# EAGLE design nanoHC06Rx (EAGLE 9.6.1)
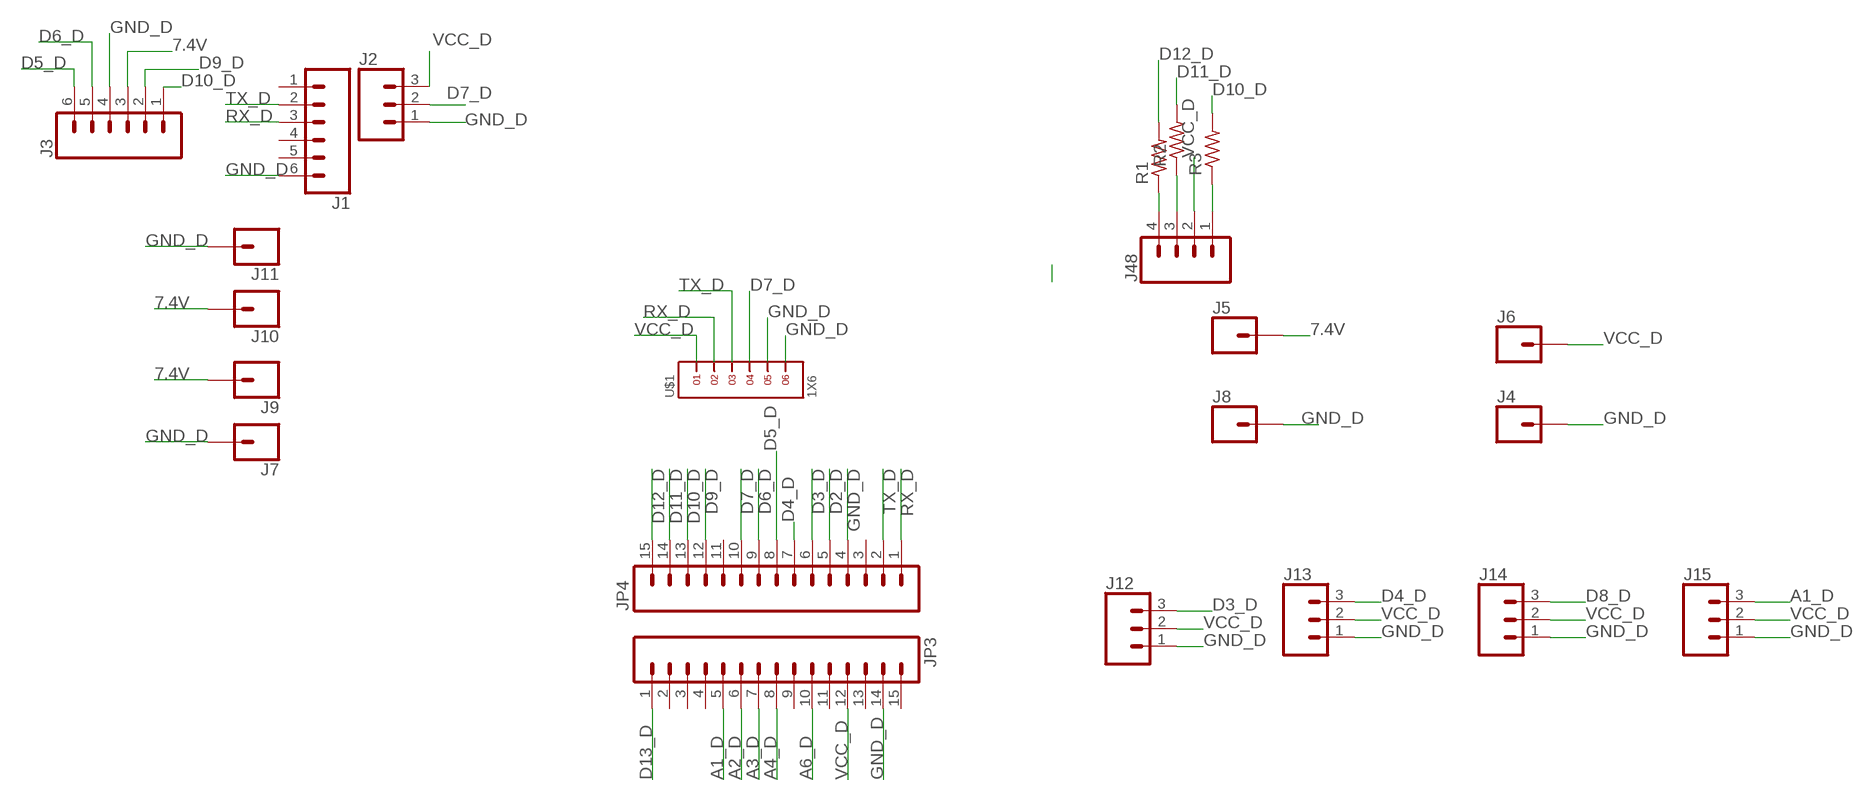
[diagram p0: schematic, sheet 1]

## Parts
J1  CONN_06SILK_FEMALE_PTH  [1X06]
J2  CONN_03  [1X03]
J3  CONN_06SILK_FEMALE_PTH  [1X06]
J4  CONN_01  [1X01]
J5  CONN_01  [1X01]
J6  CONN_01  [1X01]
J7  CONN_01  [1X01]
J8  CONN_01  [1X01]
J9  CONN_01  [1X01]
J10  CONN_01  [1X01]
J11  CONN_01  [1X01]
J12  CONN_03  [1X03]
J13  CONN_03  [1X03]
J14  CONN_03  [1X03]
J15  CONN_03  [1X03]
J48  CONN_04  [1X04]
JP3  M15  [1X15@1]
JP4  M15  [1X15@1]
R1  R-US_0309/10  [0309/10]
R2  R-US_0309/10  [0309/10]
R3  R-US_0309/10  [0309/10]
U$1  1X6  [1X6]

## Nets
7.4V: J3.3 J5.1 J9.1 J10.1
A1_D: J15.3 JP3.5
A2_D: JP3.6
A3_D: JP3.7
A4_D: JP3.8
A6_D: JP3.10
D2_D: JP4.5
D3_D: J12.3 JP4.6
D4_D: J13.3 JP4.7
D5_D: J3.6 JP4.8
D6_D: J3.5 JP4.9
D7_D: J2.2 JP4.10 U$1.4
D8_D: J14.3
D9_D: J3.2 JP4.12
D10_D: J3.1 JP4.13 R3.2
D11_D: JP4.14 R2.2
D12_D: JP4.15 R1.2
D13_D: JP3.1
GND_D: J1.6 J2.1 J3.4 J4.1 J7.1 J8.1 J11.1 J12.1 J13.1 J14.1 J15.1 JP3.14 JP4.4 U$1.5 U$1.6
N$2: J48.4 R1.1
N$3: J48.3 R2.1
N$4: J48.1 R3.1
RX_D: J1.3 JP4.1 U$1.2
TX_D: J1.2 JP4.2 U$1.3
VCC_D: J2.3 J6.1 J12.2 J13.2 J14.2 J15.2 J48.2 JP3.12 U$1.1
Unconnected: J1.1 J1.4 J1.5 JP3.2 JP3.3 JP3.4 JP3.9 JP3.11 JP3.13 JP3.15 JP4.3 JP4.11

## Library data of the parts
J1 J3 = SparkFun-Connectors:CONN_06: Multi connection point. Often used as Generic Header-pin footprint for 0.1 inch spaced/style header connections On any of the 0.1 inch spaced packages, you can populate with these: Break Away Headers - Straight <https://www.sparkfun.com/products/116> (PRT-00116) Break Away Male Headers - Right Angle <https://www.sparkfun.com/products/553> (PRT-00553) Female Headers <https://www.sparkfun.com/products/115> (PRT-00115) Break Away Headers - Machine Pin <https://www.sparkfun.com/products/117> (PRT-00117) Break Away Female Headers - Swiss Machine Pin <https://www.sparkfun.com/products/743> (PRT-00743) Arduino Stackable Header - 6 Pin <https://www.sparkfun.com/products/9280> (PRT-09280) For SCREWTERMINALS and SPRING TERMINALS visit here: Screw Terimnals on SparkFun.com <https://www.sparkfun.com/search/results?term=Screw+Terminals> (5mm/3.5mm/2.54mm spacing) This device is also useful as a general connection point to wire up your design to another part of your project. Our various solder wires solder well into these plated through hole pads. Hook-Up Wire - Assortment (Stranded, 22 AWG) <https://www.sparkfun.com/products/11375> (PRT-11375) Hook-Up Wire - Assortment (Solid Core, 22 AWG) <https://www.sparkfun.com/products/11367> (PRT-11367) View the entire wire category on our website here <https://www.sparkfun.com/categories/141>; PROD_ID: CONN-08437
J2 J12-J15 = SparkFun-Connectors:CONN_03: Multi connection point. Often used as Generic Header-pin footprint for 0.1 inch spaced/style header connections On any of the 0.1 inch spaced packages, you can populate with these: Break Away Headers - Straight <https://www.sparkfun.com/products/116> (PRT-00116) Break Away Male Headers - Right Angle <https://www.sparkfun.com/products/553> (PRT-00553) Female Headers <https://www.sparkfun.com/products/115> (PRT-00115) Break Away Headers - Machine Pin <https://www.sparkfun.com/products/117> (PRT-00117) Break Away Female Headers - Swiss Machine Pin <https://www.sparkfun.com/products/743> (PRT-00743) Stackable Header - 3 Pin (Female, 0.1") <https://www.sparkfun.com/products/13875> (PRT-13875) For SCREWTERMINALS and SPRING TERMINALS visit here: Screw Terimnals on SparkFun.com <https://www.sparkfun.com/search/results?term=Screw+Terminals> (5mm/3.5mm/2.54mm spacing) This device is also useful as a general connection point to wire up your design to another part of your project. Our various solder wires solder well into these plated through hole pads. Hook-Up Wire - Assortment (Stranded, 22 AWG) <https://www.sparkfun.com/products/11375> (PRT-11375) Hook-Up Wire - Assortment (Solid Core, 22 AWG) <https://www.sparkfun.com/products/11367> (PRT-11367) View the entire wire category on our website here <https://www.sparkfun.com/categories/141> Special notes: Molex polarized connector foot print use with SKU : PRT-08232 with associated crimp pins and housings.
J4-J11 = SparkFun-Connectors:CONN_01: Single connection point. Often used as Generic Header-pin footprint for 0.1 inch spaced/style header connections On any of the 0.1 inch spaced packages, you can populate with these: Break Away Headers - Straight <https://www.sparkfun.com/products/116> (PRT-00116) Break Away Male Headers - Right Angle <https://www.sparkfun.com/products/553> (PRT-00553) Female Headers <https://www.sparkfun.com/products/115> (PRT-00115) Break Away Headers - Machine Pin <https://www.sparkfun.com/products/117> (PRT-00117) Break Away Female Headers - Swiss Machine Pin <https://www.sparkfun.com/products/743> (PRT-00743) This device is also useful as a general connection point to wire up your design to another part of your project. Our various solder wires solder well into these plated through hole pads. Hook-Up Wire - Assortment (Stranded, 22 AWG) <https://www.sparkfun.com/products/11375> (PRT-11375) Hook-Up Wire - Assortment (Solid Core, 22 AWG) <https://www.sparkfun.com/products/11367> (PRT-11367) View the entire wire category on our website here <https://www.sparkfun.com/categories/141> Special notes: SMTSO-256-ET is a "flush mount" nut for a 4-40 screw. We mostly use this on specialty testbeds; it is a nice way to connect hardware to your PCB at an adjustable hieght. Also note, the SNAP packages are for using a snappable style connector. We sell a baggie of snaps and they are also used on two LilyPad designs: Snap Assortment - 30 pack (male and female) <https://www.sparkfun.com/products/11347> (DEV-11347) LilyPad Arduino SimpleSnap <https://www.sparkfun.com/products/10941> (DEV-10941) LilyPad SimpleSnap Protoboard <https://www.sparkfun.com/products/10940> (DEV-10940)
J48 = SparkFun-Connectors:CONN_04: Multi connection point. Often used as Generic Header-pin footprint for 0.1 inch spaced/style header connections On any of the 0.1 inch spaced packages, you can populate with these: Break Away Headers - Straight <https://www.sparkfun.com/products/116> (PRT-00116) Break Away Male Headers - Right Angle <https://www.sparkfun.com/products/553> (PRT-00553) Female Headers <https://www.sparkfun.com/products/115> (PRT-00115) Break Away Headers - Machine Pin <https://www.sparkfun.com/products/117> (PRT-00117) Break Away Female Headers - Swiss Machine Pin <https://www.sparkfun.com/products/743> (PRT-00743) For SCREWTERMINALS and SPRING TERMINALS visit here: Screw Terimnals on SparkFun.com <https://www.sparkfun.com/search/results?term=Screw+Terminals> (5mm/3.5mm/2.54mm spacing) This device is also useful as a general connection point to wire up your design to another part of your project. Our various solder wires solder well into these plated through hole pads. Hook-Up Wire - Assortment (Stranded, 22 AWG) <https://www.sparkfun.com/products/11375> (PRT-11375) Hook-Up Wire - Assortment (Solid Core, 22 AWG) <https://www.sparkfun.com/products/11367> (PRT-11367) View the entire wire category on our website here <https://www.sparkfun.com/categories/141> Special notes: Molex polarized connector foot print use with SKU : PRT-08231 with associated crimp pins and housings. 1MM SMD Version SKU: PRT-10208; PROD_ID: CONN-09696
JP3 JP4 = SparkFun-Connectors:M15: Header 15 Standard 15-pin 0.1" header. Use with straight break away headers (SKU : PRT-00116), right angle break away headers (PRT-00553), swiss pins (PRT-00743), machine pins (PRT-00117), and female headers (PRT-00115).
R1-R3 = resistor:R-US_: RESISTOR, American symbol
U$1 = headers(2mm):1X6

## Net classes
0 default: width 0.254 mm, clearance 0.254 mm
1 power: width 0.61 mm, drill 0.711 mm, clearance 0.33 mm
2 gnd: width 0.305 mm, drill 0.711 mm, clearance 0.254 mm
3 usbvcc: width 0.508 mm, drill 0.711 mm, clearance 0.254 mm
4 aref: width 0.406 mm

## Board
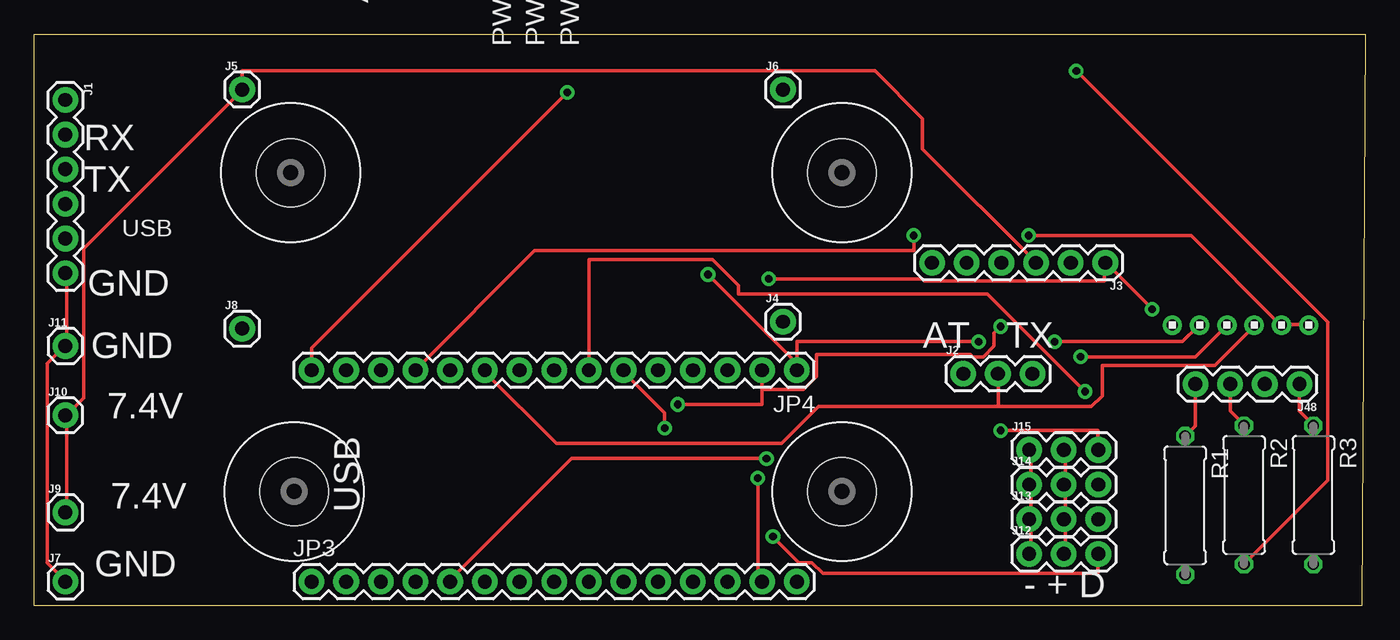
[diagram p1: board, top side]
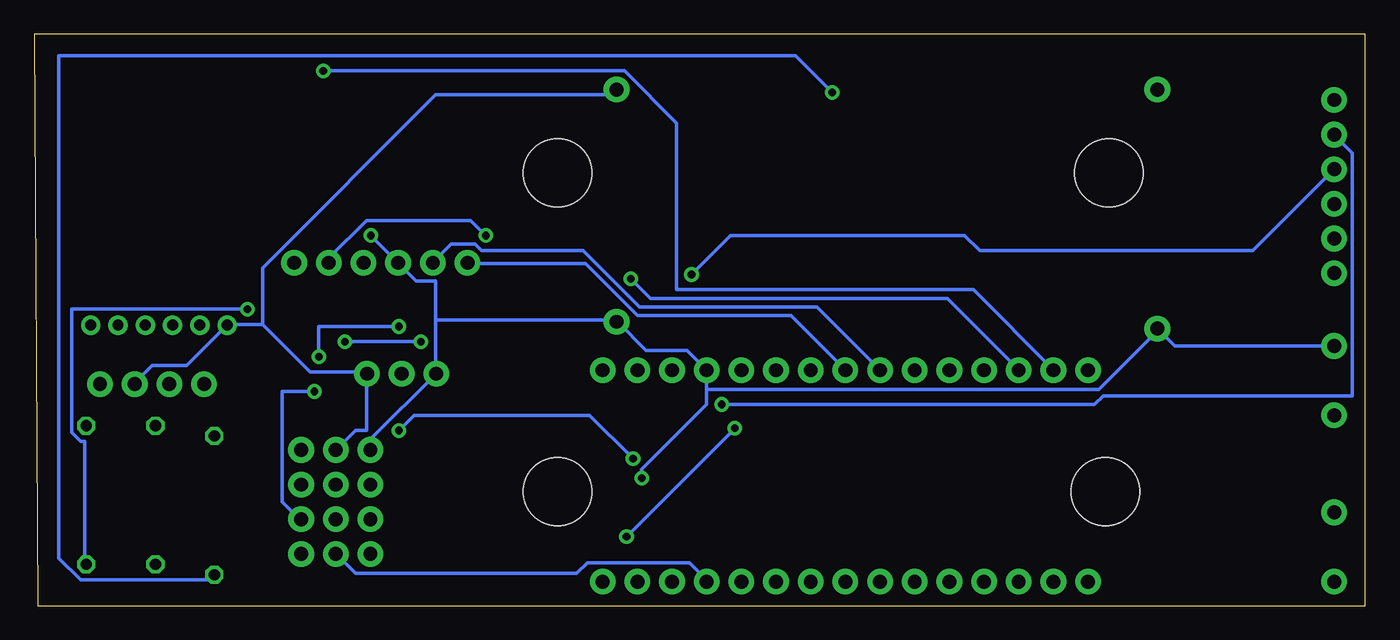
[diagram p2: board, bottom side, seen from below]

Size 97.54 x 41.91 mm. Coordinates in mm from the lower left corner, seen from the top.
Outline: 0,41.91 97.54,41.91 97.28,0 0,0 0,41.91
Copper layers (1*16): Top 0.035mm / dielectric 1.5mm / Bottom 0.035mm
Design rules "default": minimum track width 10mil, minimum drill 22mil, track to track 10mil, track to pad 10mil, pad to pad 10mil, via to via 16mil, smd to smd 8mil, copper to edge 30mil, drill to drill 12mil, minimum pad ring 10mil, minimum via ring 10mil, stop-mask expansion 4mil, vias tented up to drill 0mil, thermal gap 10mil
vRestrict: area 25.4,45.5 to 27.1,49.1; area 33.4,41 to 34.9,44.6; area 35.9,41 to 37.5,44.6; area 38.5,41 to 40,44.6; area 42.5,38.6 to 43.1,38.9

### Footprints (pad centres in the part's own frame; a part is rotated, then mirrored left to right if it is on the bottom)
1X06 = drill 1.016 pad 1.88: 1 0,0; 2 2.54,0; 3 5.08,0; 4 7.62,0; 5 10.16,0; 6 12.7,0
1X03 = drill 1.016 pad 1.88: 1 0,0; 2 2.54,0; 3 5.08,0
1X01 = drill 1.016 pad 1.88: 1 0,0
1X04 = drill 1.016 pad 1.88: 1 0,0; 2 2.54,0; 3 5.08,0; 4 7.62,0
1X15@1 = drill 1.016 pad 1.88: 1 0,0; 2 2.54,0; 3 5.08,0; 4 7.62,0; 5 10.16,0; 6 12.7,0; 7 15.24,0; 8 17.78,0; 9 20.32,0; 10 22.86,0; 11 25.4,0; 12 27.94,0; 13 30.48,0; 14 33.02,0; 15 35.56,0
0309/10 = drill 0.813 octagon: 1 -5.08,0; 2 5.08,0
1X6 = drill 0.8 pad 1.422: 1 -5,0; 2 -3,0; 3 -1,0; 4 1,0; 5 3,0; 6 5,0
DRIL-5 = hole 5: 0,0

### Placement (x,y rotation side)
J1  2.29,37.08 270 top
J2  68.07,17.02 0 top
J3  78.49,25.15 180 top
J4  54.86,20.83 0 top
J5  15.24,37.85 0 top
J6  54.86,37.85 0 top
J7  2.29,1.78 0 top
J8  15.24,20.32 0 top
J9  2.29,6.86 0 top
J10  2.29,13.97 0 top
J11  2.29,19.05 0 top
J12  72.9,3.81 0 top
J13  72.9,6.35 0 top
J14  72.9,8.89 0 top
J15  72.9,11.43 0 top
J48  92.71,16.26 180 top
JP3  20.32,1.78 0 top
JP4  55.88,17.27 180 top
R1  84.33,7.37 270 top
R2  88.65,8.13 270 top
R3  93.73,8.13 270 top
U$1  88.39,20.57 0 top
U$2  [DRIL-5]  18.8,31.75 0 top
U$3  [DRIL-5]  19.05,8.38 0 top
U$4  [DRIL-5]  59.18,31.75 0 top
U$5  [DRIL-5]  59.18,8.38 0 top

### Tracks (layer width: path | path; a pad name or v marks a point on that pad's centre or on a via)
7.4V
  Top 0.254: 2.38,13.97 2.38,6.99 J9.1 | 2.38,13.97 3.65,15.24 3.65,26.19 15.24,37.78 J5.1 15.24,39.21 61.59,39.21 65.09,35.72 65.09,33.5 73.34,25.24 J3.3 | 2.38,13.97 J10.1
A1_D  (via drill 0.56)
  Top 0.254: v53.66,10.79 39.37,10.79 30.48,1.91 JP3.5 | v70.8,12.86 77.95,12.86 77.95,11.43 J15.3
  Bottom 0.254: v53.66,10.79 56.83,13.97 69.69,13.97 v70.8,12.86
D3_D  (via drill 0.56)
  Top 0.254: v46.2,13.02 46.2,14.13 43.18,17.14 JP4.6 | v54.13,5.08 56.04,3.17 56.99,3.17 57.78,2.38 77.95,2.38 77.95,3.81 J12.3
  Bottom 0.254: v54.13,5.08 v46.2,13.02
D4_D  (via drill 0.56)
  Top 0.254: v76.99,15.72 69.85,22.86 51.59,22.86 51.59,23.5 49.69,25.4 40.64,25.4 JP4.7
  Bottom 0.254: v76.99,15.72 79.38,15.72 79.38,7.62 78.11,6.35 J13.3
D5_D
  Bottom 0.254: JP4.8 38.1,17.3 42.07,21.27 53.34,21.27 57.15,25.08 65.72,25.08 J3.6
D6_D
  Bottom 0.254: JP4.9 35.56,17.3 40.16,21.91 53.18,21.91 57.31,26.04 64.77,26.04 65.25,26.51 66.99,26.51 68.26,25.24 J3.5
D7_D
  Top 0.254: 70.64,14.61 77.47,14.61 78.26,15.4 78.26,17.62 86.52,17.62 89.38,20.48 U$1.4 | 70.64,14.61 70.64,16.99 J2.2 | 70.64,14.61 57.47,14.61 54.77,11.91 38.26,11.91 33.02,17.14 JP4.10
D9_D  (via drill 0.56)
  Top 0.254: v64.45,27.15 64.45,26.04 36.67,26.04 27.94,17.3 JP4.12
  Bottom 0.254: v64.45,27.15 65.56,28.26 73.18,28.26 75.88,25.56 75.88,25.24 J3.2
D10_D  (via drill 0.56)
  Top 0.254: v81.92,21.75 78.58,25.08 J3.1 78.42,25.08 78.42,23.81 65.25,23.81 65.09,23.97 v53.82,23.97
  Bottom 0.254: v81.92,21.75 94.77,21.75 94.77,12.7 94.14,12.06 93.82,12.06 93.82,3.17 R3.2 | v53.82,23.97 52.39,22.54 30.64,22.54 25.4,17.3 JP4.13
D11_D  (via drill 0.56)
  Top 0.254: v76.36,39.21 94.77,20.8 94.77,9.21 88.74,3.17 R2.2
  Bottom 0.254: v76.36,39.21 54.29,39.21 50.48,35.4 50.48,23.18 28.73,23.18 22.86,17.3 JP4.14
D12_D  (via drill 0.56)
  Top 0.254: v39.05,37.62 20.32,18.89 JP4.15
  Bottom 0.254: v39.05,37.62 41.75,40.32 95.73,40.32 95.73,3.49 94.14,1.91 84.77,1.91 84.45,2.22 R1.2
GND_D  (via drill 0.56)
  Top 0.254: J7.1 2.22,1.91 0.95,3.17 0.95,17.78 2.22,19.05 J11.1 2.38,19.05 2.38,24.29 J1.6 | v53.02,9.37 53.02,2.22 53.34,1.91 JP3.14 | 73.03,6.35 73.03,3.81 J12.1 | 73.03,8.89 73.03,11.43 J15.1 | 73.03,8.89 73.03,6.35 | 73.03,6.35 J13.1 | 73.03,8.89 J14.1 | U$1.6 93.34,20.64 91.44,20.64 U$1.5 91.28,20.64 84.77,27.15 v72.87,27.15
  Bottom 0.254: J11.1 13.97,19.05 J8.1 15.24,20.16 19.53,15.88 48.26,15.88 | v53.02,9.37 53.02,10 48.26,14.76 48.26,15.88 | 48.26,15.88 JP4.4 48.26,17.3 49.69,18.73 52.7,18.73 54.77,20.8 J4.1 54.93,20.95 68.1,20.95 | J15.1 72.87,11.43 72.87,12.22 J2.1 68.1,17.14 68.1,20.95 | v72.87,27.15 J3.4 69.53,23.81 68.1,23.81 68.1,20.95
N$2
  Top 0.254: J48.4 85.09,13.18 84.45,12.54 R1.1
N$3
  Top 0.254: J48.3 87.63,14.29 88.58,13.34 R2.1
N$4
  Top 0.254: J48.1 92.71,14.29 93.66,13.34 R3.1
RX_D  (via drill 0.56)
  Top 0.254: v74.77,19.37 84.14,19.37 85.25,20.48 U$1.2 | v69.22,19.37 55.88,19.37 55.88,17.78 | 55.88,17.78 v49.37,24.29 | 55.88,17.78 JP4.1
  Bottom 0.254: v69.22,19.37 v74.77,19.37 | J1.3 8.26,26.04 28.26,26.04 29.37,27.15 46.51,27.15 v49.37,24.29
TX_D  (via drill 0.56)
  Top 0.254: v76.68,18.26 85.09,18.26 87.31,20.48 U$1.3 | v70.8,20.48 70.33,20 70.33,19.05 69.53,18.26 68.74,18.26 68.58,18.41 57.31,18.41 57.31,16.83 56.36,15.88 53.34,15.88 | JP4.2 53.34,15.88 | v47.15,14.76 53.34,14.76 53.34,15.88
  Bottom 0.254: v76.68,18.26 76.68,20.48 v70.8,20.48 | v47.15,14.76 19.84,14.76 19.21,15.4 0.95,15.4 0.95,33.18 2.22,34.45 J1.2
VCC_D
  Top 0.254: 75.56,8.89 75.56,6.35 | 75.56,8.89 75.56,11.43 J15.2 | 75.56,8.89 J14.2 | 75.56,6.35 75.56,3.81 J12.2 | 75.56,6.35 J13.2
  Bottom 0.254: J15.2 75.41,11.43 73.98,12.86 73.18,12.86 73.18,16.99 J2.3 73.18,17.14 77.31,17.14 80.8,20.64 | JP3.12 48.26,1.91 49.53,3.17 56.99,3.17 57.78,2.38 73.98,2.38 75.41,3.81 J12.2 | J48.2 90.17,16.35 88.9,17.62 86.36,17.62 83.5,20.48 U$1.1 83.34,20.64 80.8,20.64 | J6.1 55.24,37.47 68.1,37.47 80.8,24.77 80.8,20.64

### Text on the board
tNames: 3 2 1 0 9 8 | GND | 1 1 1 1 | AREF | PWM | PWM | PWM | USB
Reference: C8 | C2 | R11 | C4 | C5
_tsilk: RX | TX | GND | AT | TX | GND | 7.4V | 7.4V | USB | GND | - + D